# Altium schematic sheet SheetMechanicals.SchDoc
size A
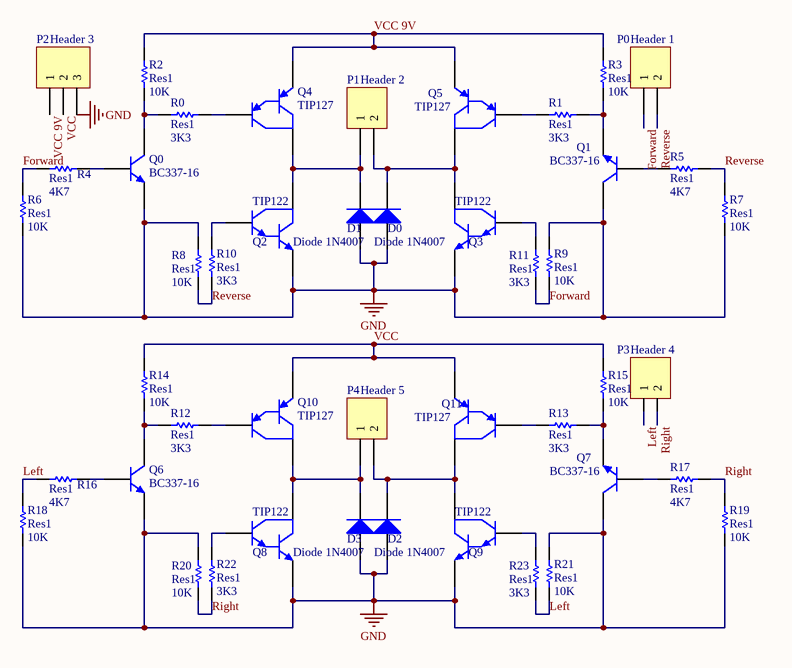
[diagram p0: SheetMechanicals.SchDoc]

## Parts
D0  Diode 1N4007  [DO-41]
D1  Diode 1N4007  [DO-41]
D2  Diode 1N4007  [DO-41]
D3  Diode 1N4007  [DO-41]
P0  Header 1  [HDR1X2]
P1  Header 2  [HDR1X2]
P2  Header 3  [HDR1X3]
P3  Header 4  [HDR1X2]
P4  Header 5  [HDR1X2]
Q0  BC337-16  [29-04]
Q1  BC337-16  [29-04]
Q2  TIP122  [221A-02]
Q3  TIP122  [221A-02]
Q4  TIP127  [221A-02]
Q5  TIP127  [221A-02]
Q6  BC337-16  [29-04]
Q7  BC337-16  [29-04]
Q8  TIP122  [221A-02]
Q9  TIP122  [221A-02]
Q10  TIP127  [221A-02]
Q11  TIP127  [221A-02]
R0  Res1  value 3K3  [AXIAL-0.3]
R1  Res1  value 3K3  [AXIAL-0.3]
R2  Res1  value 10K  [AXIAL-0.3]
R3  Res1  value 10K  [AXIAL-0.3]
R4  Res1  value 4K7  [AXIAL-0.3]
R5  Res1  value 4K7  [AXIAL-0.3]
R6  Res1  value 10K  [AXIAL-0.3]
R7  Res1  value 10K  [AXIAL-0.3]
R8  Res1  value 10K  [AXIAL-0.3]
R9  Res1  value 10K  [AXIAL-0.3]
R10  Res1  value 3K3  [AXIAL-0.3]
R11  Res1  value 3K3  [AXIAL-0.3]
R12  Res1  value 3K3  [AXIAL-0.3]
R13  Res1  value 3K3  [AXIAL-0.3]
R14  Res1  value 10K  [AXIAL-0.3]
R15  Res1  value 10K  [AXIAL-0.3]
R16  Res1  value 4K7  [AXIAL-0.3]
R17  Res1  value 4K7  [AXIAL-0.3]
R18  Res1  value 10K  [AXIAL-0.3]
R19  Res1  value 10K  [AXIAL-0.3]
R20  Res1  value 10K  [AXIAL-0.3]
R21  Res1  value 10K  [AXIAL-0.3]
R22  Res1  value 3K3  [AXIAL-0.3]
R23  Res1  value 3K3  [AXIAL-0.3]

## Nets
GND: D0.1(A) D1.1(A) D2.1(A) D3.1(A) P2.3 Q0.3(E) Q1.1(C) Q2.3(E) Q3.3(E) Q6.3(E) Q7.1(C) Q8.3(E) Q9.3(E) R6.1 R7.1 R8.1 R9.1 R18.1 R19.1 R20.1 R21.1
Forward: P0.1 R4.1 R6.2 R9.2 R11.2
Left: P3.1 R16.1 R18.2 R21.2 R23.2
Reverse: P0.2 R5.2 R7.2 R8.2 R10.2
Right: P3.2 R17.2 R19.2 R20.2 R22.2
VCC: P2.2 Q10.3(E) Q11.3(E) R14.1 R15.2
VCC 9V: P2.1 Q4.3(E) Q5.3(E) R2.1 R3.2
NetD0_2: D0.2(K) P1.2 Q3.2(C) Q5.2(C)
NetD1_2: D1.2(K) P1.1 Q2.2(C) Q4.2(C)
NetD2_2: D2.2(K) P4.2 Q9.2(C) Q11.2(C)
NetD3_2: D3.2(K) P4.1 Q8.2(C) Q10.2(C)
NetQ0_1: Q0.1(C) R0.1 R2.2
NetQ0_2: Q0.2(B) R4.2
NetQ1_2: Q1.2(B) R5.1
NetQ1_3: Q1.3(E) R1.2 R3.1
NetQ2_1: Q2.1(B) R10.1
NetQ3_1: Q3.1(B) R11.1
NetQ4_1: Q4.1(B) R0.2
NetQ5_1: Q5.1(B) R1.1
NetQ6_1: Q6.1(C) R12.1 R14.2
NetQ6_2: Q6.2(B) R16.2
NetQ7_2: Q7.2(B) R17.1
NetQ7_3: Q7.3(E) R13.2 R15.1
NetQ8_1: Q8.1(B) R22.1
NetQ9_1: Q9.1(B) R23.1
NetQ10_1: Q10.1(B) R12.2
NetQ11_1: Q11.1(B) R13.1

## Library data of the parts
D0-D3 = Diode 1N4007: 1 Amp General Purpose Rectifier; Published: 8-Jun-2000; LatestRevisionDate: 17-Jul-2002; LatestRevisionNote: Re-released for DXP Platform.; DatasheetVersion: 1998; PackageVersion: Aug-1999; PackageReference: DO-41; Publisher: Altium Limited; PackageDescription: Diode, Axial; Body 5.2 x 2.7 mm (LxDia. max), Lead Dia. 0.86 mm (max); Code_JEDEC: DO-204-AL; ComponentLink1Description: Manufacturer Link; ComponentLink1URL: http://www.fairchildsemi.com/; ComponentLink2Description: Datasheet; ComponentLink2URL: http://www.fairchildsemi.com/ds/1N%2F1N4001.pdf
P0 P1 P3 P4 = Header 2: Header, 2-Pin; LatestRevisionDate: 17-Jul-2002; LatestRevisionNote: Re-released for DXP Platform.; Publisher: Altium Limited
P2 = Header 3: Header, 3-Pin; LatestRevisionDate: 17-Jul-2002; LatestRevisionNote: Re-released for DXP Platform.; Publisher: Altium Limited
Q0 Q1 Q6 Q7 = BC337-16: Amplifier Transistor NPN Silicon; Published: 29-Sep-2000; LatestRevisionDate: 17-Jul-2002; LatestRevisionNote: Re-released for DXP Platform.; DatasheetVersion: 1991; PackageVersion: 1996; PackageReference: 29-04; Publisher: Altium Limited; PackageDescription: TO, Flat Index; 3 In-Line, Axial Leads; Body Dia. 4.8mm; Leads 0.48 x 0.5 mm (max); ComponentLink1Description: Manufacturer Link; ComponentLink1URL: http://www.onsemi.com/site/products/landing?taxonomyID=194; ComponentLink2Description: Datasheet; ComponentLink2URL: http://www.onsemi.com/pub/Collateral/BC337-D.PDF
Q2 Q3 Q8 Q9 = TIP122: Darlington Silicon Power NPN Transistor, 8 Amp, 100 Volts and 65 Watts; Note: Pin 2 is electrically connected to Pin 4 (TAB); Published: 19-Mar-2004; LatestRevisionDate: 06-Jun-2005; LatestRevisionNote: TAB pin 4 removed.; DatasheetVersion: 1984; PackageVersion: 1984; PackageReference: 221A-02; Publisher: Altium Limited; PackageDescription: TO, Thru-Hole, Vertical, Heatsink Mounted; 3 In-Line Leads; Pitch 2.54 mm; Code_JEDEC: TO-220-AB; ComponentLink1Description: Manufacturer Link; ComponentLink1URL: http://www.onsemi.com/site/products/landing?taxonomyID=194; ComponentLink2Description: Datasheet; ComponentLink2URL: http://www.onsemi.com/pub/Collateral/TIP120-D.PDF
Q4 Q5 Q10 Q11 = TIP127: Darlington Silicon Power PNP Transistor, 8 Amp, 100 Volts and 65 Watts; Note: Pin 2 is electrically connected to Pin 4 (TAB); Published: 19-Mar-2004; LatestRevisionDate: 06-Jun-2005; LatestRevisionNote: TAB pin 4 removed.; DatasheetVersion: 1984; PackageVersion: 1984; PackageReference: 221A-02; Publisher: Altium Limited; PackageDescription: TO, Thru-Hole, Vertical, Heatsink Mounted; 3 In-Line Leads; Pitch 2.54 mm; Code_JEDEC: TO-220-AB; ComponentLink1Description: Manufacturer Link; ComponentLink1URL: http://www.onsemi.com/site/products/landing?taxonomyID=194; ComponentLink2Description: Datasheet; ComponentLink2URL: http://www.onsemi.com/pub/Collateral/TIP120-D.PDF
R0-R23 = Res1: Resistor; Published: 8-Jun-2000; LatestRevisionDate: 17-Jul-2002; LatestRevisionNote: Re-released for DXP Platform.; PackageReference: AXIAL-0.3; Publisher: Altium Limited; PackageDescription: Axial Device, Thru-Hole; 2 Leads; 0.3 in Pin Spacing